# Altium schematic sheet Voltage Reference.SchDoc
size A
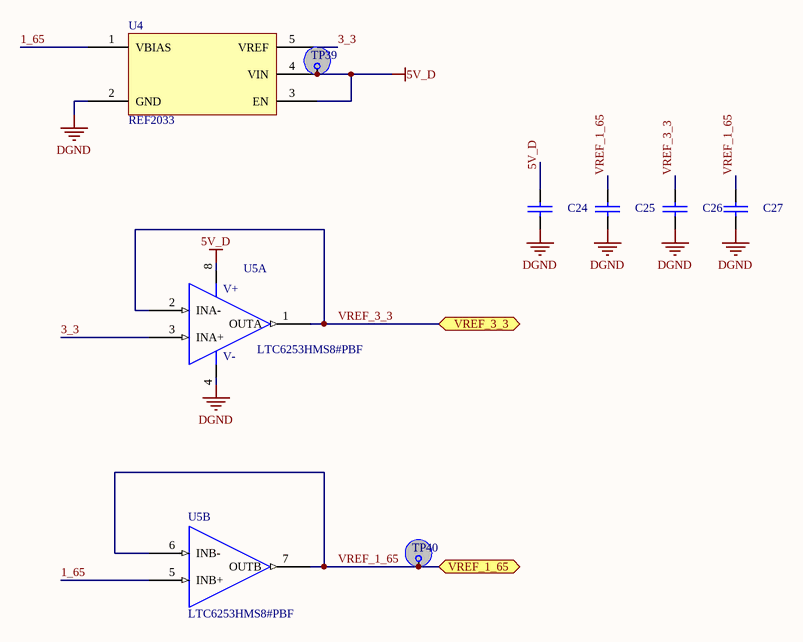
[diagram p0: Voltage Reference.SchDoc]

## Parts
C24  CAP 0603 100nF 100V  [CAPC1608N]  (value not drawn)
C25  CAP 0603 100nF 100V  [CAPC1608N]  (value not drawn)
C26  CAP 0603 100nF 100V  [CAPC1608N]  (value not drawn)
C27  CAP 0603 100nF 100V  [CAPC1608N]  (value not drawn)
TP39  *  [Keystone 5000]  (value not drawn)
TP40  *  [Keystone 5000]  (value not drawn)
U4  REF2033  [SOT-23 5 PIN]
U5  LTC6253HMS8#PBF  [SOIC-8]  (parts A,B of 2)

## Ports
VREF_1_65, VREF_3_3

## Nets
5V_D: C24.2 TP39.1 U4.3(EN) U4.4(VIN) U5.8(V+)
DGND: C24.1 C25.1 C26.1 C27.1 U4.2(GND) U5.4(V-)
1_65: U4.1(VBIAS) U5.5(INB+)
3_3: U4.5(VREF) U5.3(INA+)
VREF_1_65: C25.2 C27.2 TP40.1 U5.6(INB-) U5.7(OUTB) ; port VREF_1_65
VREF_3_3: C26.2 U5.1(OUTA) U5.2(INA-) ; port VREF_3_3

## Library data of the parts
C24-C27 = CAP 0603 TBD: Vendor: TBD; Part#: TBD; Manuf: TBD; Manuf#: TBD; Cost: TBD
TP39 TP40 = TEST_POINT_HOOK
U5 = LTC6253HMS8#PBF: 720MHz, 3.5mA Power / Efficient Rail-to-Rail / I/O Op Amps; Manufacturer: Texas Instruments; GENERIC_PART_NUMBER: OPA2140; Manufacturer_Part_Number: opa2140_d_8; INDUSTRY_STD_PKG_TYPE: SOIC; FAMILY_NAME: LOW INPUT BIAS CURRENT/FET INPUT; PIN_COUNT: 8; PACKAGE_DESIGNATOR: D; Datasheet URL: http://www.ti.com/lit/gpn/OPA2140; Vendor: Texas Instruments; RefDes: RefDes; Type: DEV; Value: Value